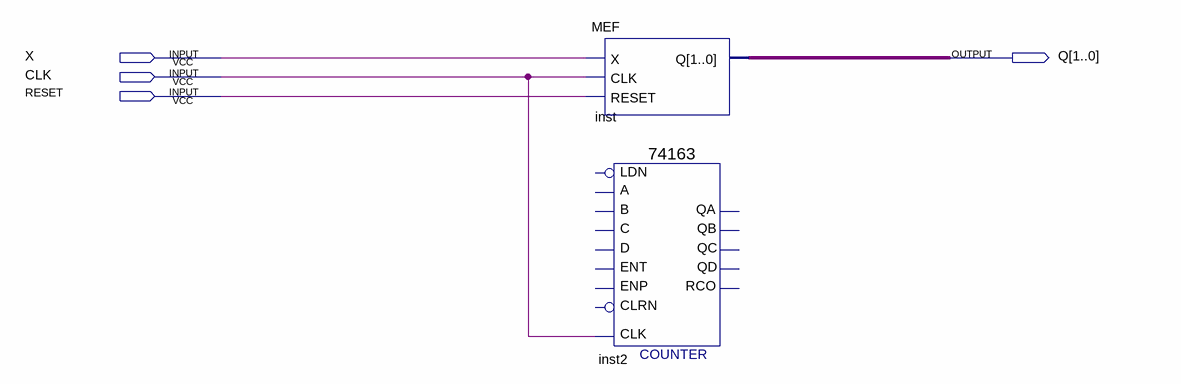
[diagram p0: schematic sheet]
// Quartus schematic SpecialCount.bdf as structural Verilog: 2 symbols, 4 pins
module SpecialCount (
  input  X,
  input  CLK,
  input  RESET,
  output [1:0] Q
);

  MEF inst (.X(X), .CLK(CLK), .RESET(RESET), .Q(Q));
  \74163  inst2 (.CLK(CLK));  // open: C, B, A, ENT, D, CLRN, ENP, LDN, QA, QB, QC, QD, RCO
endmodule
